# EAGLE design PM_DC_v1.0 (EAGLE 9.6.2)
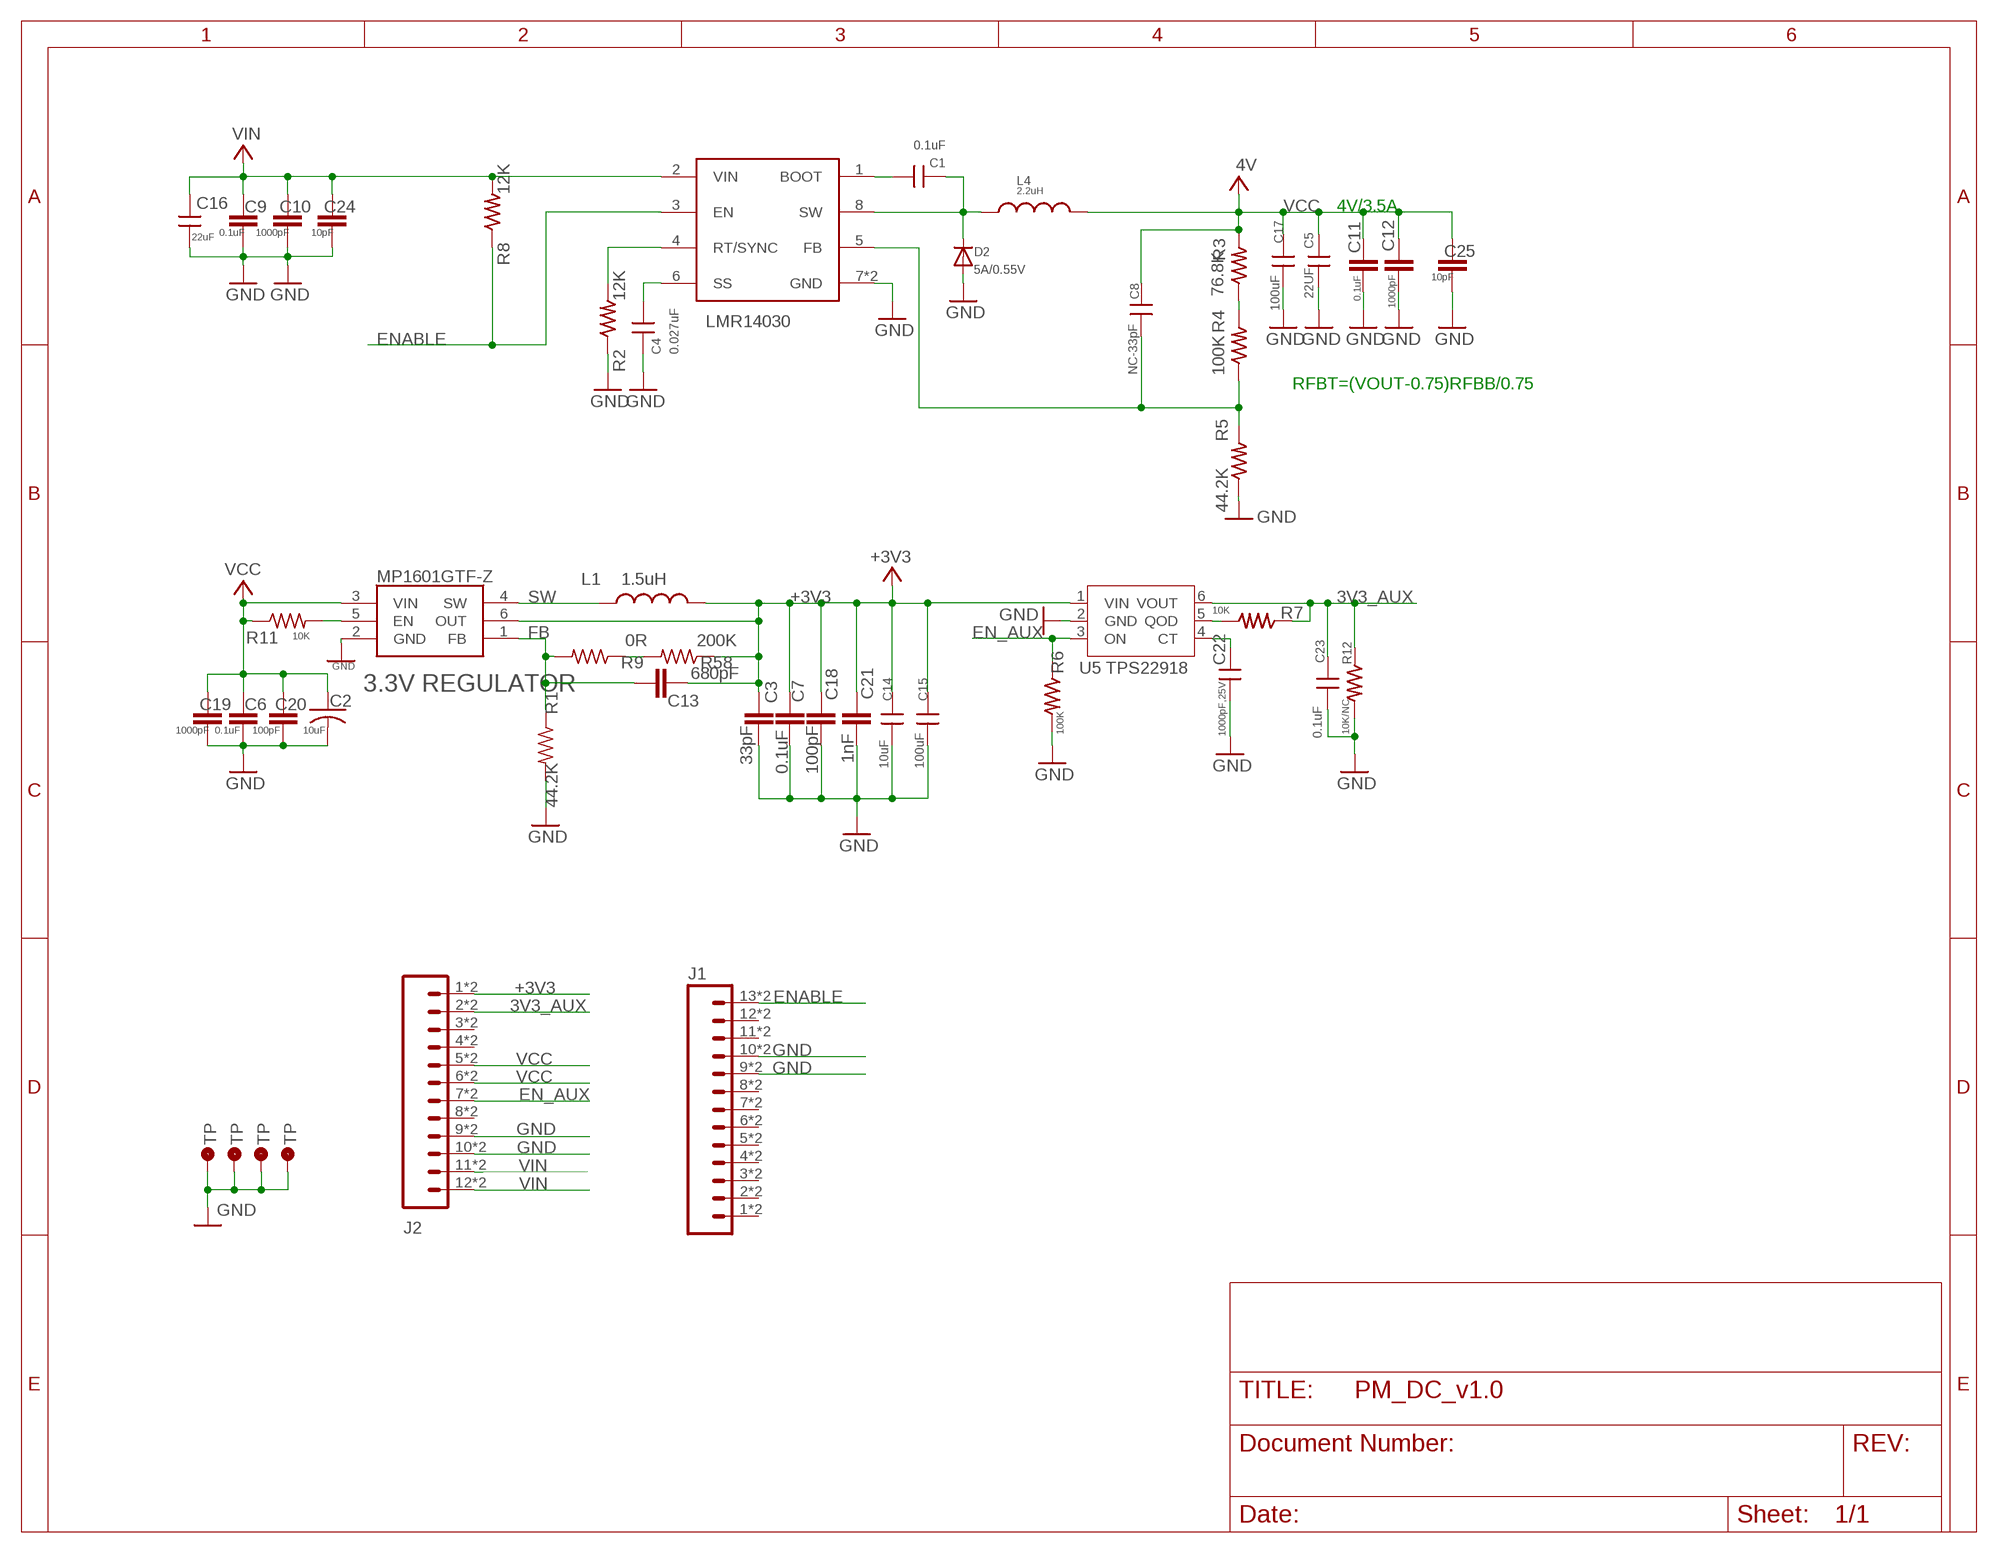
[diagram p0: schematic, sheet 1]

## Parts
C1  0.1uF  CAP0402A  [C0402]
C2  10uF  C-US0603  [C0603_B]
C3  33pF  CAP_1  [C0402_B]
C4  0.027uF  CAP0402A  [C0402]
C5  22UF  CAPC0805  [C0805]
C6  0.1uF  CAP_1  [C0402_B]
C7  0.1uF  CAP_1  [C0402_B]
C8  NC-33pF  CAP0402A  [C0402]
C9  0.1uF  CAP_1  [C0402_B]
C10  1000pF  CAP_1  [C0402_B]
C11  0.1uF  CAP_1  [C0402_B]
C12  1000pF  CAP_1  [C0402_B]
C13  680pF  CAP_1  [C0402_B]
C14  10uF  CAPC0805  [C0805]
C15  100uF  CAPC1206  [C1206]
C16  22uF  CAP  [C805]
C17  100uF  CAPC1206  [C1206]
C18  100pF  CAP_1  [C0402_B]
C19  1000pF  CAP_1  [C0402_B]
C20  100pF  CAP_1  [C0402_B]
C21  1nF  CAP_1  [C0402_B]
C22  1000pF,25V  CAP0402A  [C0402]
C23  0.1uF  CAP0402  [C-0402]
C24  10pF  CAP_1  [C0402_B]
C25  10pF  CAP_1  [C0402_B]
D2  5A/0.55V  DIODESMA  [SMADIODE]
J1  M13PTH-CST-R  [1X13-CASTELLATED]
J2  M12PTH-CST-R  [1X12-CASTELLATED]
L1  1.5uH  INDUCTOR-SPARKFUNINDUCTOR-2520  [INDUCTOR-2520]
L4  2.2uH  INDUCTORI  [INDUCTOR-4040]
R1  44.2K  R-US_  [R0402_B]
R2  12K  RES0402S  [R-0402S]
R3  76.8K  RES0402S  [R-0402S]
R4  100K  RES0402S  [R-0402S]
R5  44.2K  RES0402S  [R-0402S]
R6  100K  RESR0402  [R0402]
R7  10K  RESR0402  [R0402]
R8  12K  RES0402S  [R-0402S]
R9  0R  R-US_  [R0402_B]
R11  10K  R-US_  [R0402_B]
R12  10K/NC  RESR0402  [R0402]
R58  200K  R-US_  [R0402_B]
U2  LMR14030  [SO_POWERPAD_8]
U3  MP1601GTF-Z  [SOTFL50P160X60-6N]
U5  TPS22918  [SOT-23-6]
U$1  TP  [TP_2.33X1.37]
U$2  TP  [TP_2.33X1.37]
U$4  TP  [TP_2.33X1.37]
U$5  TP  [TP_2.33X1.37]

## Nets
3V3_AUX: C23.1 J2.2 J2.@2 R7.1 R12.1 U5.6(VOUT)
+3V3: C3.2 C7.2 C13.1 C14.1 C15.1 C18.2 C21.2 J2.1 J2.@1 L1.2 R58.1 U3.6(OUT) U5.1(VIN)
EN_AUX: J2.7 J2.@7 R6.1 U5.3(ON)
ENABLE: J1.13 J1.@13 R8.1 U2.3(EN)
FB: C13.2 R1.1 R9.2 U3.1(FB)
GND: C2.2 C3.1 C4.2 C5.2 C6.1 C7.1 C9.1 C10.1 C11.1 C12.1 C14.2 C15.2 C16.2 C17.2 C18.1 C19.1 C20.1 C21.1 C22.2 C23.2 C24.1 C25.1 D2.A J1.9 J1.10 J1.@9 J1.@10 J2.9 J2.10 J2.@9 J2.@10 R1.2 R2.1 R5.1 R6.2 R12.2 U2.7(GND) U2.EP(GND) U3.2(GND) U5.2(GND) U$1.1(TP) U$2.1(TP) U$4.1(TP) U$5.1(TP)
N$1: R7.2 U5.5(QOD)
N$2: C8.1 R4.1 R5.2 U2.5(FB)
N$3: R11.2 U3.5(EN)
N$4: R9.1 R58.2
N$8: C4.1 U2.6(SS)
N$9: C1.2 D2.C L4.P$1 U2.8(SW)
N$10: C1.1 U2.1(BOOT)
N$11: R2.2 U2.4(RT/SYNC)
N$12: R3.1 R4.2
N$18: C22.1 U5.4(CT)
SW: L1.1 U3.4(SW)
VCC: C2.1 C5.1 C6.2 C8.2 C11.2 C12.2 C17.1 C19.2 C20.2 C25.2 J2.5 J2.6 J2.@5 J2.@6 L4.P$2 R3.2 R11.1 U3.3(VIN) ; supply symbol labelled 4V
VIN: C9.2 C10.2 C16.1 C24.2 J2.11 J2.12 J2.@11 J2.@12 R8.2 U2.2(VIN)
Unconnected: J1.1 J1.2 J1.3 J1.4 J1.5 J1.6 J1.7 J1.8 J1.11 J1.12 J1.@1 J1.@2 J1.@3 J1.@4 J1.@5 J1.@6 J1.@7 J1.@8 J1.@11 J1.@12 J2.3 J2.4 J2.8 J2.@3 J2.@4 J2.@8

## Notes on the sheet
- 4V/3.5A
- RFBT=(VOUT-0.75)RFBB/0.75
- 3.3V REGULATOR

## Library data of the parts
C1 C4 C5 C8 C14-C17 = particle SZ:CAP: CAP
C2 = Bretts-Spark-Library:C-US: Capacitor
C3 C6 C7 C9-C13 C18-C21 C24 C25 = Particle:CAP_1
C22 = particle SZ:CAP: CAP; ITEM_NAME: CAP CER 100PF 50V C0G/NP0 0603 5%; ITEM_NUMBER: PT-200458
C23 = particle SZ:CAP: CAP; ITEM_NAME: 0.1UF 16V X7R 0402 10%; ITEM_NUMBER: PT-200649
D2 = particle-studios:DIODE: Diode SMADIODE - SMA Surface Mount Package 20V 1A Schottky Diode Digikey: 641-1014-6-ND DO-1N4148 - Through Hole Small Current Diode SOD-123 20V 1 A (.5mV Vf) Schottky Diode - Digikey: MBRX120TPMSCT-ND SOD-323 10V 570mA (.38mV Vf, 3ns) Schottky Diode - Digikey: ZLLS410CT-ND SOD-523 30V 30mA Schottky Diode (RB751S-40TE61) - Digikey: RB751S-40TE61CT-ND SOT23-R/W - SOT23 Package (R = Solder Paste/Reflow Ovens, W = Hand-Soldering) BAT54Film 40V 300mA - Digikey: 497-7162-1-ND
J1 = Particle:M13PTH-CST-R
J2 = Particle:M12: Header 12 Standard 12-pin 0.1" header. Use with straight break away headers (SKU : PRT-00116), right angle break away headers (PRT-00553), swiss pins (PRT-00743), machine pins (PRT-00117), and female headers (PRT-00115).
L1 = PM-BAT v0.5-35X22.86:INDUCTOR-SPARKFUN: Inductors Basic Inductor/Choke - 0603 and 1206. Footprints are not proven and vary greatly between part numbers. SRN6045- 33uH, 20% 1.4A
L4 = Particle:INDUCTOR; ITEM_NAME: FIXED IND 1UH 5.8A 26 MOHM SMD 4020; ITEM_NUMBER: 155-00005
R1 R9 R58 = Particle:R-US_: 0402 Resistor
R2-R5 R8 = particle SZ:RES: RES
R6 = particle SZ:RES: RES; ITEM_NAME: RES SMD 1M OHM 1% 1/16W 0402; ITEM_NUMBER: PT-201084
R7 R12 = particle SZ:RES: RES; ITEM_NAME: 10K OHM 5% 1/16W 0402; ITEM_NUMBER: PT-200004
R11 = Spark:R-US_: 0402 Resistor
U2 = particle-studios:LMR14030
U3 = MP1601GTF-Z:MP1601GTF-Z: Conv DC-DC Single Step Down 2.3V to 5.5V 6-Pin SOT-563 T/R - Tape and Reel Source: Datasheet <https://www.monolithicpower.com/en/documentview/productdocument/index/version/2/document_type/Datasheet/lang/en/sku/MP1601/document_id/1038/>; DESCRIPTION: Conv DC-DC Single Step Down 2.3V to 5.5V 6-Pin SOT-563 T/R - Tape and Reel; HEIGHT: 0.6mm; MANUFACTURER_NAME: Monolithic Power Systems (MPS); MANUFACTURER_PART_NUMBER: MP1601GTF-Z
U5 = particle SZ:TPS22918
U$1 U$2 U$4 U$5 = Particle:TP: Test Points of all sizes and shapes

## Net classes
0 default: width 0.152 mm, drill 0.203 mm, clearance 0.152 mm
1 power: width 0.254 mm, drill 0.61 mm, clearance 0.203 mm
3 BAT: clearance 0.203 mm
4 3V3: width 0.305 mm, clearance 0.508 mm
6 +3V3: width 0.203 mm, clearance 0.152 mm

## Board
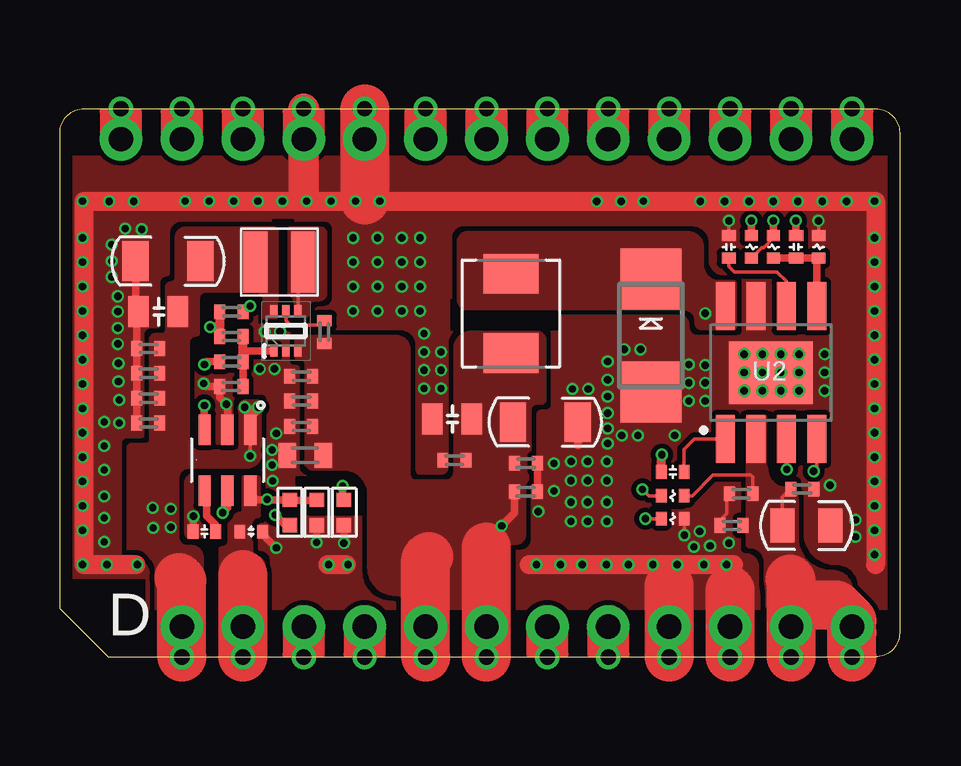
[diagram p1: board, top side]
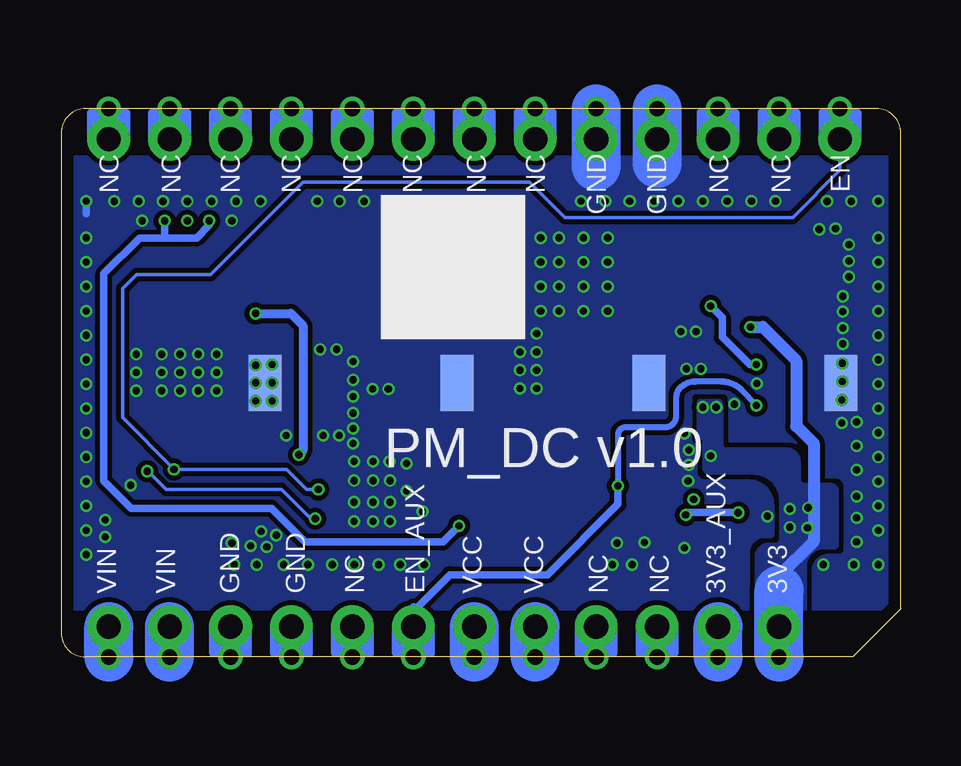
[diagram p2: board, bottom side, seen from below]

Size 35 x 22.86 mm. Coordinates in mm from the lower left corner, seen from the top.
Outline: 2,0 34,0 arc90 35,1 35,21.86 arc90 34,22.86 1,22.86 arc90 0,21.86 0,2 2,0
Copper layers (1*16): Top 0.035mm / dielectric 1.5mm / Bottom 0.035mm
Design rules "default *": minimum track width 6mil, minimum drill 8mil, track to track 8mil, track to pad 6mil, pad to pad 6mil, via to via 6mil, smd to smd 6mil, copper to edge 20mil, drill to drill 6mil, minimum pad ring 4mil, minimum via ring 4mil, stop-mask expansion 4mil, vias tented up to drill 20mil, thermal gap 10mil
tRestrict: 1 lines

### Footprints (pad centres in the part's own frame; a part is rotated, then mirrored left to right if it is on the bottom)
C0402 = smd 0.45 x 0.6: 1 -0.47,0; 2 0.47,0
C0603_B = smd 0.711 x 1.041: 1 -0.749,0; 2 0.749,0
C0402_B = smd 0.457 x 0.61: 1 -0.483,0; 2 0.483,0
C0805 = smd 0.85 x 1.3: 1 -0.8,0; 2 0.85,0
C1206 = smd 1.1 x 1.65: 1 -1.35,0; 2 1.35,0
C805 = smd 1 x 1.4: 1 -1,0; 2 1,0
C-0402 = smd 0.45 x 0.55: 1 -0.47,0; 2 0.47,0
SMADIODE = smd 2.54 x 2.54: A 2.349,0; C -2.349,0
1X13-CASTELLATED = drill 1.016 pad 1.778: 1 0,-15.24; 2 0,-12.7; 3 0,-10.16; 4 0,-7.62; 5 0,-5.08; 6 0,-2.54; 7 0,0; 8 0,2.54; 9 0,5.08; 10 0,7.62; 11 0,10.16; 12 0,12.7; 13 0,15.24 | drill 0.635 pad 1.016: @1 1.27,-15.24; @2 1.27,-12.7; @3 1.27,-10.16; @4 1.27,-7.62; @5 1.27,-5.08; @6 1.27,-2.54; @7 1.27,0; @8 1.27,2.54; @9 1.27,5.08; @10 1.27,7.62; @11 1.27,10.16; @12 1.27,12.7; @13 1.27,15.24
1X12-CASTELLATED = drill 1.016 pad 1.778: 1 0,-13.97; 2 0,-11.43; 3 0,-8.89; 4 0,-6.35; 5 0,-3.81; 6 0,-1.27; 7 0,1.27; 8 0,3.81; 9 0,6.35; 10 0,8.89; 11 0,11.43; 12 0,13.97 | drill 0.635 pad 1.016: @1 1.27,-13.97; @2 1.27,-11.43; @3 1.27,-8.89; @4 1.27,-6.35; @5 1.27,-3.81; @6 1.27,-1.27; @7 1.27,1.27; @8 1.27,3.81; @9 1.27,6.35; @10 1.27,8.89; @11 1.27,11.43; @12 1.27,13.97
INDUCTOR-2520 = smd 1.02 x 2.54: 1 -1,0; 2 1,0
INDUCTOR-4040 = smd 1.65 x 2.3: P$1 -1.65,0; P$2 1.65,0
R0402_B = smd 0.457 x 0.61: 1 -0.483,0; 2 0.483,0
R-0402S = smd 0.45 x 0.55: 1 -0.47,0; 2 0.47,0
R0402 = smd 0.6 x 0.6: 1 -0.525,0; 2 0.525,0
SO_POWERPAD_8 = smd 0.8 x 2: 1 -1.905,-2.775; 2 -0.635,-2.775; 3 0.635,-2.775; 4 1.905,-2.775; 5 1.905,2.775; 6 0.635,2.775; 7 -0.635,2.775; 8 -1.905,2.775 | smd 3.5 x 2.6: EP 0,0
SOTFL50P160X60-6N = smd 0.475 x 0.3: 1 -0.838,0.5; 2 -0.838,0; 3 -0.838,-0.5; 4 0.838,-0.5; 5 0.838,0; 6 0.838,0.5
SOT-23-6 = smd 1.27 x 0.508: 1 -1.27,0.953; 2 -1.27,0; 3 -1.27,-0.953; 4 1.27,-0.953; 5 1.27,0; 6 1.27,0.953
TP_2.33X1.37 = smd 1.37 x 2.33: 1 0,0

### Placement (x,y rotation side)
C1  25.55,7.71 180 top
C2  10.23,8.41 180 top
C3  3.68,9.76 0 top
C4  27.89,17.1 90 top
C5  16.37,9.92 180 top
C6  10.05,9.61 0 top
C7  3.68,12.86 0 top
C8  30.69,17.1 90 top
C9  30.95,7 180 top
C10  27.99,5.48 0 top
C11  16.44,8.2 0 top
C12  19.43,8.07 180 top
C13  7.15,13.36 0 top
C14  4.12,14.4 180 top
C15  4.5,16.5 180 top
C16  31.12,5.48 0 top
C17  20.23,9.79 0 top
C18  3.68,11.83 0 top
C19  10.05,10.68 0 top
C20  10.05,11.7 0 top
C21  3.68,10.79 0 top
C22  6.02,5.23 180 top
C23  7.97,5.23 0 top
C24  28.39,6.8 0 top
C25  19.43,6.89 180 top
D2  24.63,13.4 270 top
J1  17.78,21.59 90 top
J2  19.05,1.27 270 top
L1  9.14,16.46 180 top
L4  18.8,14.32 270 top
R1  7.15,11.28 180 top
R2  25.55,5.77 180 top
R3  28.83,17.1 90 top
R4  29.74,17.1 90 top
R5  31.63,17.1 270 top
R6  11.84,6.02 270 top
R7  9.58,6.02 270 top
R8  25.55,6.72 0 top
R9  7.15,12.31 0 top
R11  11.02,13.54 90 top
R12  10.7,6.02 270 top
R58  7.15,14.39 0 top
U2  29.64,11.86 0 top
U3  9.42,13.59 90 top
U5  6.98,8.21 270 top
U$1  10.5,11.43 0 bottom
U$2  2.5,11.43 0 bottom
U$4  26.5,11.43 0 bottom
U$5  18.5,11.43 0 bottom

### Tracks (layer width: path | path; a pad name or v marks a point on that pad's centre or on a via)
3V3_AUX  (via drill 0.3 pad 0.5)
  Top 0.152: 7.93,6.51 7.93,6.81 U5.6 8.3,6.57 v8.64,6.57
  Top 0.305: R12.1 10.68,6.52 9.6,6.52 R7.1 8.19,6.55 7.93,6.81
  Top 0.508: J2.@2 J2.2
  Top 2.032: 7.62,3.43 J2.@2
  Bottom 2.032: J2.@2 J2.2
  pour Top (no thermals): 7.7,7.52 8.26,7.52 arc-90 8.33,7.44 8.33,5.92 arc-90 8.26,5.84 arc90 8,5.59 8,4.34 arc90 8.18,4.17 arc-90 8.51,3.84 8.51,0.25 6.76,0.25 arc-90 6.65,0.36 6.65,4.47 arc-90 6.76,4.57 arc90 7.04,4.85 7.04,5.44 arc-90 7.62,6.02 7.62,7.44 arc-90
+3V3  (via drill 0.3 pad 0.5)
  Top 0.152: U5.1 7.93,9.22 7.93,8.39 v7.92,8.38
  Top 0.254: 7.93,10.09 7.93,9.22
  Top 0.381: R58.1 C13.1 6.66,13.74 6.65,13.76 v6.26,13.76
  Top 0.508: J2.1 J2.@1 | U5.1 7.93,10.09 v8.26,10.41
  Top 2.032: J2.@1 5.08,3.17 4.95,3.3
  Bottom 0.508: v6.26,13.76 5.75,13.76 4.36,12.36 4.36,9.63 3.63,8.91 3.63,4.81 5.08,3.36 5.08,2.79 J2.1 | J2.1 5.28,1.27 | J2.@1 J2.1
  Bottom 2.032: J2.@1 5.08,2.79
  other vias: 7.7,10.41 4.62,5.41 4.62,6.17 3.86,6.22 3.89,5.38
  pour Top (no thermals): 9.07,14.2 9.07,17.7 arc90 8.86,17.91 5.26,17.91 arc90 4.83,17.48 4.83,15.8 arc-90 4.65,15.62 arc90 4.42,15.39 4.42,13.61 arc-90 4.27,13.46 3.99,13.46 arc90 3.76,13.23 3.76,9.02 arc-90 3.63,8.89 3.02,8.89 arc90 2.82,8.69 2.82,4.52 arc90 3.1,4.24 3.43,4.24 arc-90 3.99,3.68 3.99,0.74 arc90 4.24,0.48 5.89,0.48 arc90 5.94,0.53 5.94,4.17 arc90 5.49,4.62 5.31,4.62 arc-90 4.93,5 4.93,8.64 arc-90 5.13,8.84 arc90 5.36,9.07 5.36,13.08 arc-90 5.69,13.41 arc90 5.79,13.51 5.79,14.96 arc-90 6.07,15.24 8.13,15.24 arc-90 8.51,14.86 8.51,14.12 8.99,14.12 arc90
  pour Top (no thermals): 5.36,9.7 5.36,9.07 arc90 5.82,8.61 7.34,8.61 arc90 7.47,8.74 7.47,10.36 arc-90 7.8,10.69 8.2,10.69 arc-90 8.36,10.54 8.36,8.43 arc-90 7.82,7.9 5.38,7.9 arc90 4.93,7.44 4.93,6.81 arc90 4.9,6.83 4.37,6.83 arc-90 4.34,6.86 4.34,9.58 arc-90 4.47,9.7
  pour Bottom: 7.62,10.72 8.33,10.72 arc-90 8.46,10.59 8.46,9.3 arc-90 8.28,9.12 arc90 8.23,9.07 8.23,7.92 arc-90 7.95,7.65 6.15,7.65 arc90 5.03,6.53 5.03,4.88 arc90 5.18,4.72 5.49,4.72 arc-90 6.05,4.17 6.05,0.58 arc-90 5.97,0.51 4.11,0.51 arc-90 3.96,0.66 3.96,3.78 arc90 3.21,4.54 2.77,4.54 arc-90 2.62,4.7 2.62,6.88 arc-90 2.95,7.21 4.01,7.21 arc90 4.22,7.42 4.22,8.13 arc-90 4.78,8.69 7.29,8.69 arc90 7.44,8.84 7.44,10.54 arc-90
EN_AUX  (via drill 0.3 pad 0.5)
  Top 0.305: R6.1 11.79,6.6 v11.79,7.14 | U5.3 v6.02,10.49
  Top 0.508: J2.@7 J2.7
  Bottom 0.254: v6.02,10.49 6.02,10.52 6.63,11.12 arc-45 7.49,11.48 8.56,11.48 arc-45 9.2,11.21 arc-45 9.37,10.79 9.37,10.03 arc90 9.83,9.58 11.48,9.58 arc-90 11.79,9.27 | 11.79,9.3 11.79,9.27 | 11.79,9.27 v11.79,7.14
  Bottom 0.305: 20.32,2.08 J2.7 20.32,1.91 18.8,3.43 14.73,3.43 11.79,6.38 v11.79,7.14
ENABLE  (via drill 0.3 pad 0.5)
  Top 0.152: U2.3 30.28,7.92 30.34,7.86 v30.3,7.82 | 25.08,6.56 R8.1 24.54,6.72 v24.28,6.99
  Bottom 0.152: v24.28,6.99 24.77,6.99 25.6,7.82 v30.3,7.82 30.3,7.85 32.44,9.98 32.44,15.37 31.85,15.95 28.76,15.95 24.91,19.8 15.48,19.8 14,18.32 4.51,18.32 2.54,20.29 J1.13 2.54,21.13 2.69,20.98 2.69,22.71 J1.@13
FB
  Top 0.305: U3.1 7.75,12.75 7.63,12.88 C13.2 | R1.1 R9.2
  Top 0.381: R9.2 C13.2
GND  (via drill 0.3 pad 0.5)
  Top 0.152: R5.1 v31.63,18.18 v31.62,18.19 | C4.2 v27.89,18.18 v27.89,18.19 | R2.1 26.04,5.75 v26.04,5.08 | C24.1 27.81,6.7 27.81,5.98 27.51,5.68 C10.1
  Top 0.305: U5.2 6.98,10.5 6.66,10.82 R1.2 6.12,11.28 v5.99,11.4 | C23.2 8.44,5.12 v9.02,4.54 | R12.2 v10.7,4.78 v10.69,4.78 | R6.2 v11.84,4.75 | C22.2 v5.55,5.86 v5.56,5.87 | C12.1 C25.1 | C17.2 21.59,8.81 | C3.1 C21.1 C18.1 C7.1 3.2,14.33 C14.2 3.15,14.52 C15.2 | C5.2 15.52,9.59
  Top 0.508: J2.@10 J2.10 | J1.@9 12.7,21.16 12.78,21.08 | J1.@10 J1.10
  Top 0.8: v33.96,19 1,19 1,3.86 3.17,3.86 | 11.18,3.86 11.94,3.86 | 19.56,3.86 28.09,3.86 | 34,19 34,3.86
  Top 1.27: 10.19,22.84 J1.@10 10.16,19.33
  Top 2.032: J1.@9 12.7,19.05 | J2.@9 25.4,2.98 | J2.@10 27.94,2.79
  Bottom 0.305: v33.96,19.01 33.96,18.49
  Bottom 0.508: J2.@9 J2.9
  Bottom 2.032: J1.@10 10.16,20.57 | J1.@9 12.7,20.45
  other vias: 8.94,12.01 9.02,9.32 8.84,8 8.84,8.64 21.31,8.15 20.6,8.07 20.6,6.93 21.36,11.17 19.94,6.06 22.83,10.17 22.83,9.53 22.83,8.9 22,8.15 23.42,9.23 24.09,9.23 9.17,13.56 8.53,13.56 6.93,10.54 23.52,12.83 24.21,12.83 25.63,9.23 15.18,11.2 31.88,12.62 31.88,11.86 31.88,11.1 32.11,7.16 33.16,5.71 33.16,5.01 26.43,4.59 27.1,4.63 27.89,4.75 2.16,17.2 2.16,16.51 2.16,15.85 2.72,17.86 3.4,17.83 2.41,15.04 2.41,14.4 2.41,13.06 2.41,13.72 2.46,9.75 26.67,5.23 0.94,19.01 2.06,19 3.07,19 6.22,19.01 7.24,19.01 8.25,19.01 9.27,19.01 10.29,19.01 11.3,19.01 12.32,19.01 26.7,19 27.71,19 28.73,19 29.74,19 30.76,19 31.78,19 32.79,19 33.96,17.48 33.96,16.46 33.96,15.44 33.96,14.43 33.96,13.41 33.96,12.4 33.96,11.38 33.96,10.36 33.96,9.35 33.96,8.33 33.96,7.32 33.96,6.3 33.96,5.28 33.96,4.27 0.94,17.48 0.94,16.46 0.94,15.44 0.94,14.43 0.94,13.41 0.94,12.4 0.94,11.38 0.94,10.36 0.94,9.35 0.94,8.33 0.94,7.32 0.94,6.3 0.94,5.28 0.94,3.85 1.96,3.85 3.23,3.85 11.2,3.85 12.02,3.85 21.77,3.85 22.78,3.85 23.7,3.85 24.72,3.85 25.73,3.85 26.85,3.85 27.79,3.85 13.33,19.01 22.38,19 23.39,19 24.33,19.01 12.22,17.48 12.22,16.46 12.22,15.44 12.22,14.43 13.23,17.48 13.23,16.46 13.23,15.44 13.23,14.43 14.25,17.48 14.25,16.46 14.25,15.44 14.25,14.43 28.52,12.62 29.29,12.62 30.05,12.62 30.81,12.62 28.52,11.86 29.29,11.86 30.05,11.86 30.81,11.86 28.52,11.1 29.29,11.1 30.05,11.1 30.81,11.1 8.33,12.01 8.86,7.34 15.88,11.2 15.18,11.96 15.18,12.72 15.88,11.96 15.88,12.72 15.18,13.48 15.01,14.43 15.01,15.44 15.01,16.46 15.01,17.48 22.02,11.17 22.83,12.32 22.83,11.56 26.9,10.67 26.21,10.67 26.21,11.43 26.21,12.19 26.9,11.43 26.9,12.17 2.44,12.24 2.44,11.48 2.46,10.72 20.87,3.85 19.87,3.85 22,7.35 22,6.45 22,5.65 21.3,7.35 21.3,6.45 21.3,5.65 22.83,10.86 1.84,6.7 1.84,5.8 1.84,4.8 1.84,7.8 1.84,8.8 1.84,9.8 22.8,8.15 22.8,7.35 22.8,6.45 22.8,5.65 5.22,19.01
  pour Bottom (rank 4, no thermals): -0.76,25.65 35.56,25.65 35.56,-1.27 -1.78,-1.27 -1.78,25.65
  pour Top (rank 4, no thermals): -0.25,23.88 35.31,23.88 35.31,-0.76 -0.51,-0.76 -0.51,23.88
  cutout Top: 16.33,14.88 16.33,13.66 20.8,13.66 20.8,14.25 arc90 20.65,14.4 16.54,14.4 arc-90 16.41,14.53 16.41,14.71
  cutout Top: 5.23,4.9 6.55,4.9 arc-90 6.65,4.8 6.65,4.75 5.38,4.75 arc-90
  cutout Top: 6.76,11.91 7.82,11.91 7.82,14.99 6.76,14.99
  cutout Top: 24.89,8.05 26.21,8.05 26.21,6.5 arc-90 25.93,6.22 24.64,6.22 arc90 24.89,6.48
  cutout Top: 30.66,10.21 31.17,10.21 31.17,8.05 30.71,8.05 arc-90 30.66,8.1
  cutout Top: 29.87,17.4 31.04,17.4 arc-90 31.14,17.3 31.14,13.51 29.87,13.51
  cutout Top: 9.86,7.49 9.86,5.94 12.52,5.94 arc90 12.55,5.97 12.55,6.96 arc90 12.04,7.47 arc90 12.01,7.49
  cutout Bottom: -0.05,1.88 34.72,1.88 34.72,-0.71 34.7,-0.74 -0.12,-0.74
  cutout Bottom: -1.02,23.88 35.31,23.88 35.31,20.95 -1.02,20.95
  cutout Top: -1.14,23.88 -1.14,20.95 35.31,20.95 35.31,23.88
  cutout Top: -0.05,1.91 35.05,1.91 35.05,-0.76 -0.05,-0.76
  cutout Top: 0,3.2 0,0.4 3.4,0.4 3.5,0.3 3.5,3.2
N$1  (via drill 0.3 pad 0.5)
  Top 0.152: U5.5 7.04,6.99 7.04,7.49
  Top 0.305: R7.2 9.38,5.5 v8.97,5.92 | U5.5 6.98,6.22 v6.78,6.02
  Bottom 0.305: v8.97,5.92 8.87,6.02 v6.78,6.02
N$2
  Top 0.152: C8.1 | U2.5 31.67,14.76 | 31.65,16.65 R5.2 31.55,16.55
  Top 0.305: R4.1 C8.1 | C8.1 R5.2 | U2.5 31.55,16.55 31.65,16.65
N$3
  Top 0.152: R11.2 10.84,13.84 9.6,13.84 9.42,14.03 U3.5
N$4  (via drill 0.3 pad 0.5)
  Top 0.305: v7.92,14.63 7.69,14.39 R58.2 | v6.02,12.19 6.14,12.31 R9.1
  Bottom 0.305: v7.92,14.63 7.44,14.15 7.44,13.34 6.3,12.19 v6.02,12.19
N$8
  Top 0.152: U2.6 30.28,15.67 29.9,16.05 28.12,16.05 27.89,16.29 C4.1
N$9  (via drill 0.3 pad 0.5)
  Top 0.381: C1.2 25.08,8.41 v25.09,8.43
  Bottom 0.381: v26.9,14.33 25.43,14.33 24.92,13.82 24.92,8.61 v25.09,8.43
  pour Top (no thermals): 17.02,17.71 26.16,17.71 arc-90 26.8,17.08 26.8,16.36 arc90 27.48,15.67 28.07,15.67 arc-90 28.17,15.57 28.17,13.77 arc-90 28.07,13.67 26.77,13.67 arc-90 26.49,13.94 26.49,14.02 arc90 26.01,14.5 16.99,14.5 arc-90 16.59,14.91 16.59,17.28 arc-90
N$10
  Top 0.152: C1.1 26.02,8.64 26.45,9.08 U2.1
N$11  (via drill 0.3 pad 0.5)
  Top 0.152: v31.42,7.75 31.55,7.87 U2.4 | R2.2 v24.41,5.77
  Bottom 0.152: v31.42,7.75 31.39,7.75 30.63,6.99 25.81,6.99 24.59,5.77 v24.41,5.77
N$12  (via drill 0.3 pad 0.5)
  Top 0.152: v29.74,18.19 | R3.1 29.27,17.07 29.34,17.07 29.74,17.48 R4.2
  Top 0.305: R4.2 v29.74,18.19
N$18
  Top 0.305: C22.1 6.49,5.51 6.12,5.89 6.12,6.85 U5.4
SW
  Top 0.152: L1.1 9.92,16.4 U3.4
  pour Top (no thermals): 9.53,17.81 9.53,15.14 arc90 9.6,15.06 9.63,15.06 arc-90 9.75,14.94 9.75,14.22 arc90 9.78,14.2 10.24,14.2 arc90 10.36,14.33 10.36,14.63 arc-90 10.59,14.86 10.74,14.86 arc90 11.1,15.21 11.1,17.65 arc90 10.85,17.91 9.63,17.91 arc90
VCC  (via drill 0.3 pad 0.5)
  Top 0.152: v30.68,18.18 v30.68,18.19
  Top 0.305: R3.2 v28.83,18.18 v28.83,18.19 | C8.2 v30.68,18.18 | C25.2 18.95,6 v18.41,5.46
  Top 0.508: J2.@5 J2.5 | J2.@6 J2.6
  Top 2.032: J2.@5 15.24,4.06 15.37,4.19 | J2.@6 17.78,4.57
  Bottom 0.305: v30.68,18.19 30.68,17.48 | 30.68,17.48 29.36,17.48 28.83,18.01 v28.83,18.19 | v18.41,5.46 19.09,4.79 24.83,4.79 26.24,6.2 32.08,6.2 33.22,7.34 33.22,15.98 31.73,17.48 30.68,17.48
  Bottom 2.032: J2.@5 J2.5 | J2.@6 J2.6
  pour Top: 18.57,1.27 arc-90 18.24,0.94 14.94,0.94 arc-90 14.35,1.52
  pour Top (no thermals): 17.14,13.55 19.9,13.55 arc-90 20.23,13.22 20.23,10.73 arc-90 20.07,10.57 19.89,10.57 arc90 19.61,10.29 19.61,7.39 arc-90 19.56,7.34 arc90 19.38,7.16 19.38,5.08 arc-90 19.02,4.72 18.87,4.72 arc90 18.67,4.52 18.67,0.81 arc-90 18.64,0.79 14.45,0.79 arc-90 14.38,0.86 14.38,7.35 16.08,7.35 arc90 16.44,7.71 16.44,12.85 arc-90
  pour Top (no thermals): 9.83,13.21 9.83,12.55 arc90 9.96,12.42 10.06,12.42 arc-90 10.24,12.24 10.24,8.13 arc90 10.54,7.82 11.81,7.82 arc-90 12.85,6.78 12.85,3.73 arc90 14,2.59 arc-90 14.43,2.16 14.43,0.69 arc90 14.45,0.66 15.98,0.66 15.98,7.33 14.84,7.33 arc-90 14.58,7.59 14.58,12.8 arc90 14,13.39 10.01,13.39 arc90
VIN
  Top 0.152: R8.2 26.36,6.72 27.23,7.59 28.78,7.59 28.88,7.5 C24.2 | C16.1 30.12,6.66 C9.2
  Top 0.508: J2.@11 J2.11 | J2.@12 J2.12
  Top 2.032: J2.@11 30.48,2.16 | 30.48,2.16 30.48,3.21 30.43,3.26 | 33.02,1.02 J2.@12 33.02,1.52 32.38,2.16 30.48,2.16
  Bottom 2.032: J2.@11 J2.11 | J2.@12 J2.12
  pour Top (isolate 0.406, no thermals): 28.63,10.01 29.49,10.01 29.49,7.82 arc90 30.25,7.06 arc-90 30.76,6.55 30.76,4.98 arc90 32.15,3.59 32.2,3.59 arc-90 33.02,2.77 arc90 33.48,2.31 33.66,2.31 arc-90 33.99,1.98 33.99,0.53 arc-90 33.96,0.51 29.39,0.51 29.39,3.96 arc90 28.78,4.57 arc-90 28.63,4.72

### Text on the board
tPlace: U2 | D
bPlace: EN | NC | NC | NC | NC | NC | NC | NC | NC | NC | NC | GND | GND | PM_DC v1.0 | 3V3 | 3V3_AUX | NC | NC | VCC | VCC | EN_AUX | NC | GND | GND | VIN | VIN